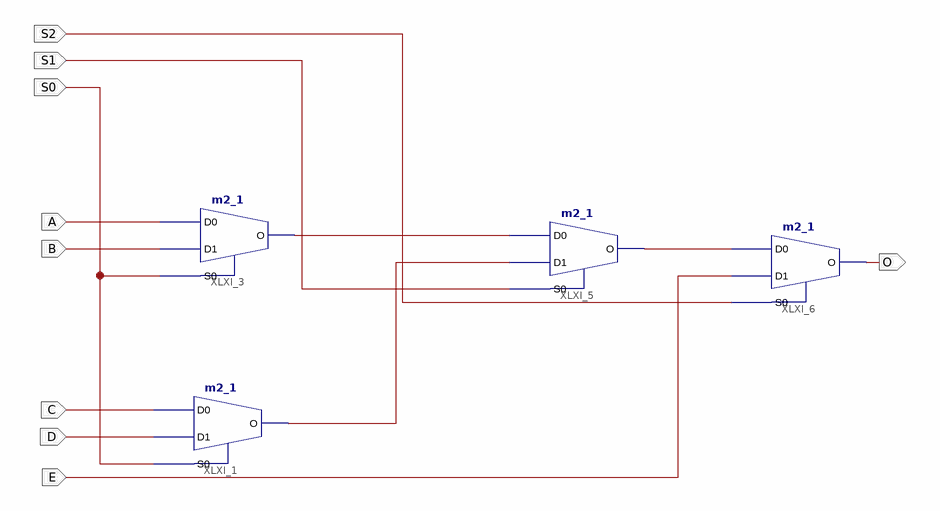
[diagram p0: schematic sheet 1]
// Xilinx ISE schematic Mux5to1.sch (spartan3e) as structural Verilog: 4 symbols, 9 ports
module Mux5to1 (
  input  A,
  input  B,
  input  C,
  input  D,
  input  E,
  input  S2,
  input  S0,
  input  S1,
  output O
);

  wire XLXN_1, XLXN_5, XLXN_10;

  m2_1 XLXI_1 (.D0(C), .D1(D), .S0(S0), .O(XLXN_10));
  m2_1 XLXI_6 (.D0(XLXN_1), .D1(E), .S0(S2), .O(O));
  m2_1 XLXI_5 (.D0(XLXN_5), .D1(XLXN_10), .S0(S1), .O(XLXN_1));
  m2_1 XLXI_3 (.D0(A), .D1(B), .S0(S0), .O(XLXN_5));
endmodule
